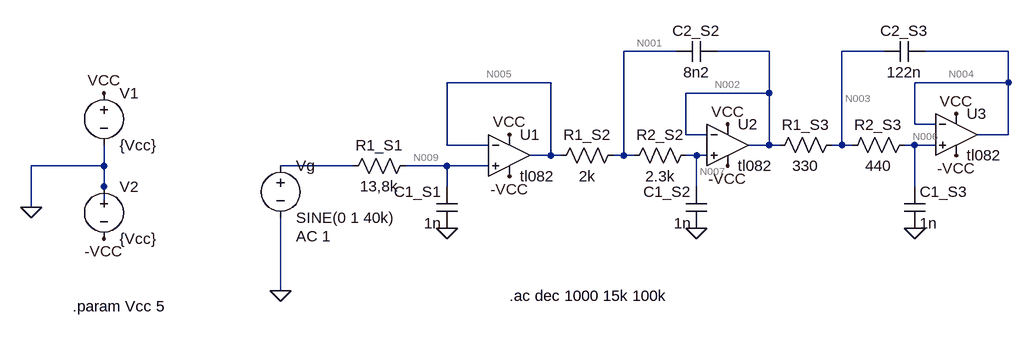
[diagram p0: schematic Filtro.asc]
* Filtro.asc
* U1: tl082 (symbol tl082 not available, pins judged from their places): In+=N009 In-=N005 V+=VCC V-=-VCC OUT=N005
* U2: tl082 (symbol tl082 not available, pins judged from their places): In+=N007 In-=N002 V+=VCC V-=-VCC OUT=N002
* U3: tl082 (symbol tl082 not available, pins judged from their places): In+=N006 In-=N004 V+=VCC V-=-VCC OUT=N004
R1_S2 N001 N005 2k
R2_S2 N007 N001 2.3k
R1_S1 N009 N008 13,8k
R1_S3 N003 N002 330
R2_S3 N006 N003 440
C1_S1 0 N009 1n
C1_S2 0 N007 1n
C2_S2 N001 N002 8n2
C2_S3 N003 N004 122n
C1_S3 N006 0 1n
V1 VCC 0 {Vcc}
Vg N008 0 SINE(0 1 40k) AC 1
V2 0 -VCC {Vcc}
.ac dec 1000 15k 100k
.param Vcc 5
.backanno
.end

* Results of the author's LTspice run, read from the files saved beside the schematic
* Operating Point, zero values left out:
*   V(n005) = 10.69 µV
*   V(-vcc) = -5 V
*   V(vcc) = 5 V
*   V(n009) = -280.4 nV
*   V(n002) = 21.51 µV
*   V(n007) = 10.54 µV
*   V(n004) = 32.45 µV
*   V(n006) = 21.48 µV
*   V(n001) = 10.62 µV
*   V(n003) = 21.5 µV
*   I(R2_s3) = -35.05 pA
*   I(R1_s3) = -35.05 pA
*   I(R1_s1) = -35.05 pA
*   I(R2_s2) = -35.05 pA
*   I(R1_s2) = -35.05 pA
*   I(V2) = -14.59 mA
*   I(Vg) = -35.05 pA
*   I(V1) = -14.58 mA
*   Ix(u1:1) = 35.05 pA
*   Ix(u1:2) = 35.05 pA
*   Ix(u1:3) = 4.861 mA
*   Ix(u1:4) = -4.862 mA
*   Ix(u1:5) = -70.11 pA
*   Ix(u2:1) = 35.05 pA
*   Ix(u2:2) = 35.05 pA
*   Ix(u2:3) = 4.861 mA
*   Ix(u2:4) = -4.862 mA
*   Ix(u2:5) = -70.11 pA
*   Ix(u3:1) = 35.05 pA
*   Ix(u3:2) = 35.05 pA
*   Ix(u3:3) = 4.861 mA
*   Ix(u3:4) = -4.862 mA
*   Ix(u3:5) = -35.05 pA
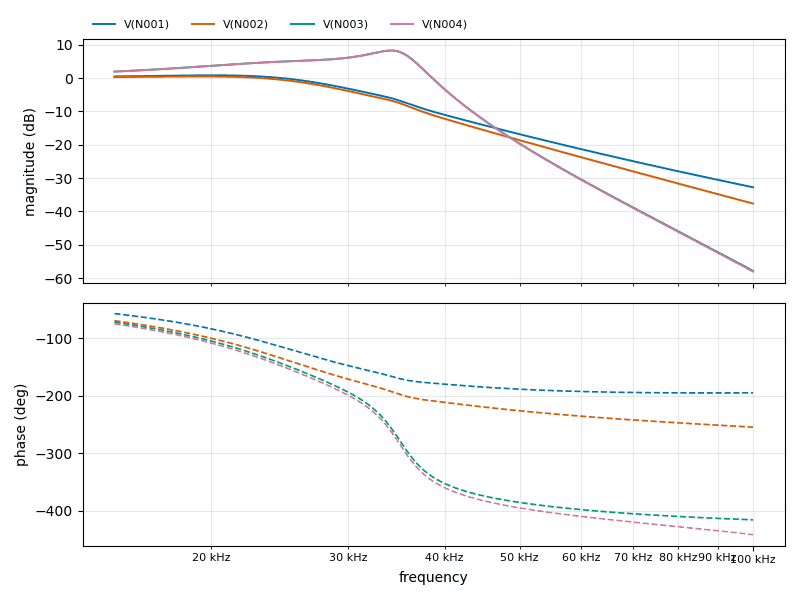
[diagram p1: AC Analysis of Filtro.asc, plotted from the saved traces]
* AC Analysis, 1 run:
*   V(N001): 0.48 dB at 15 kHz, -32.78 dB at 100 kHz, peak 0.82 dB at 19.91 kHz, 3 dB below the peak at 28.58 kHz
*   V(N002): 0.28 dB at 15 kHz, -37.67 dB at 100 kHz, peak 0.49 dB at 19.23 kHz, 3 dB below the peak at 28.11 kHz
*   V(N003): 1.93 dB at 15 kHz, -57.87 dB at 100 kHz, peak 8.26 dB at 34.13 kHz, 3 dB below the peak at 26.59 kHz and 36.46 kHz
*   V(N004): 1.92 dB at 15 kHz, -58.08 dB at 100 kHz, peak 8.22 dB at 34.13 kHz, 3 dB below the peak at 26.49 kHz and 36.46 kHz